# EAGLE design MKL05Z_1.1 (EAGLE 7.4.0)
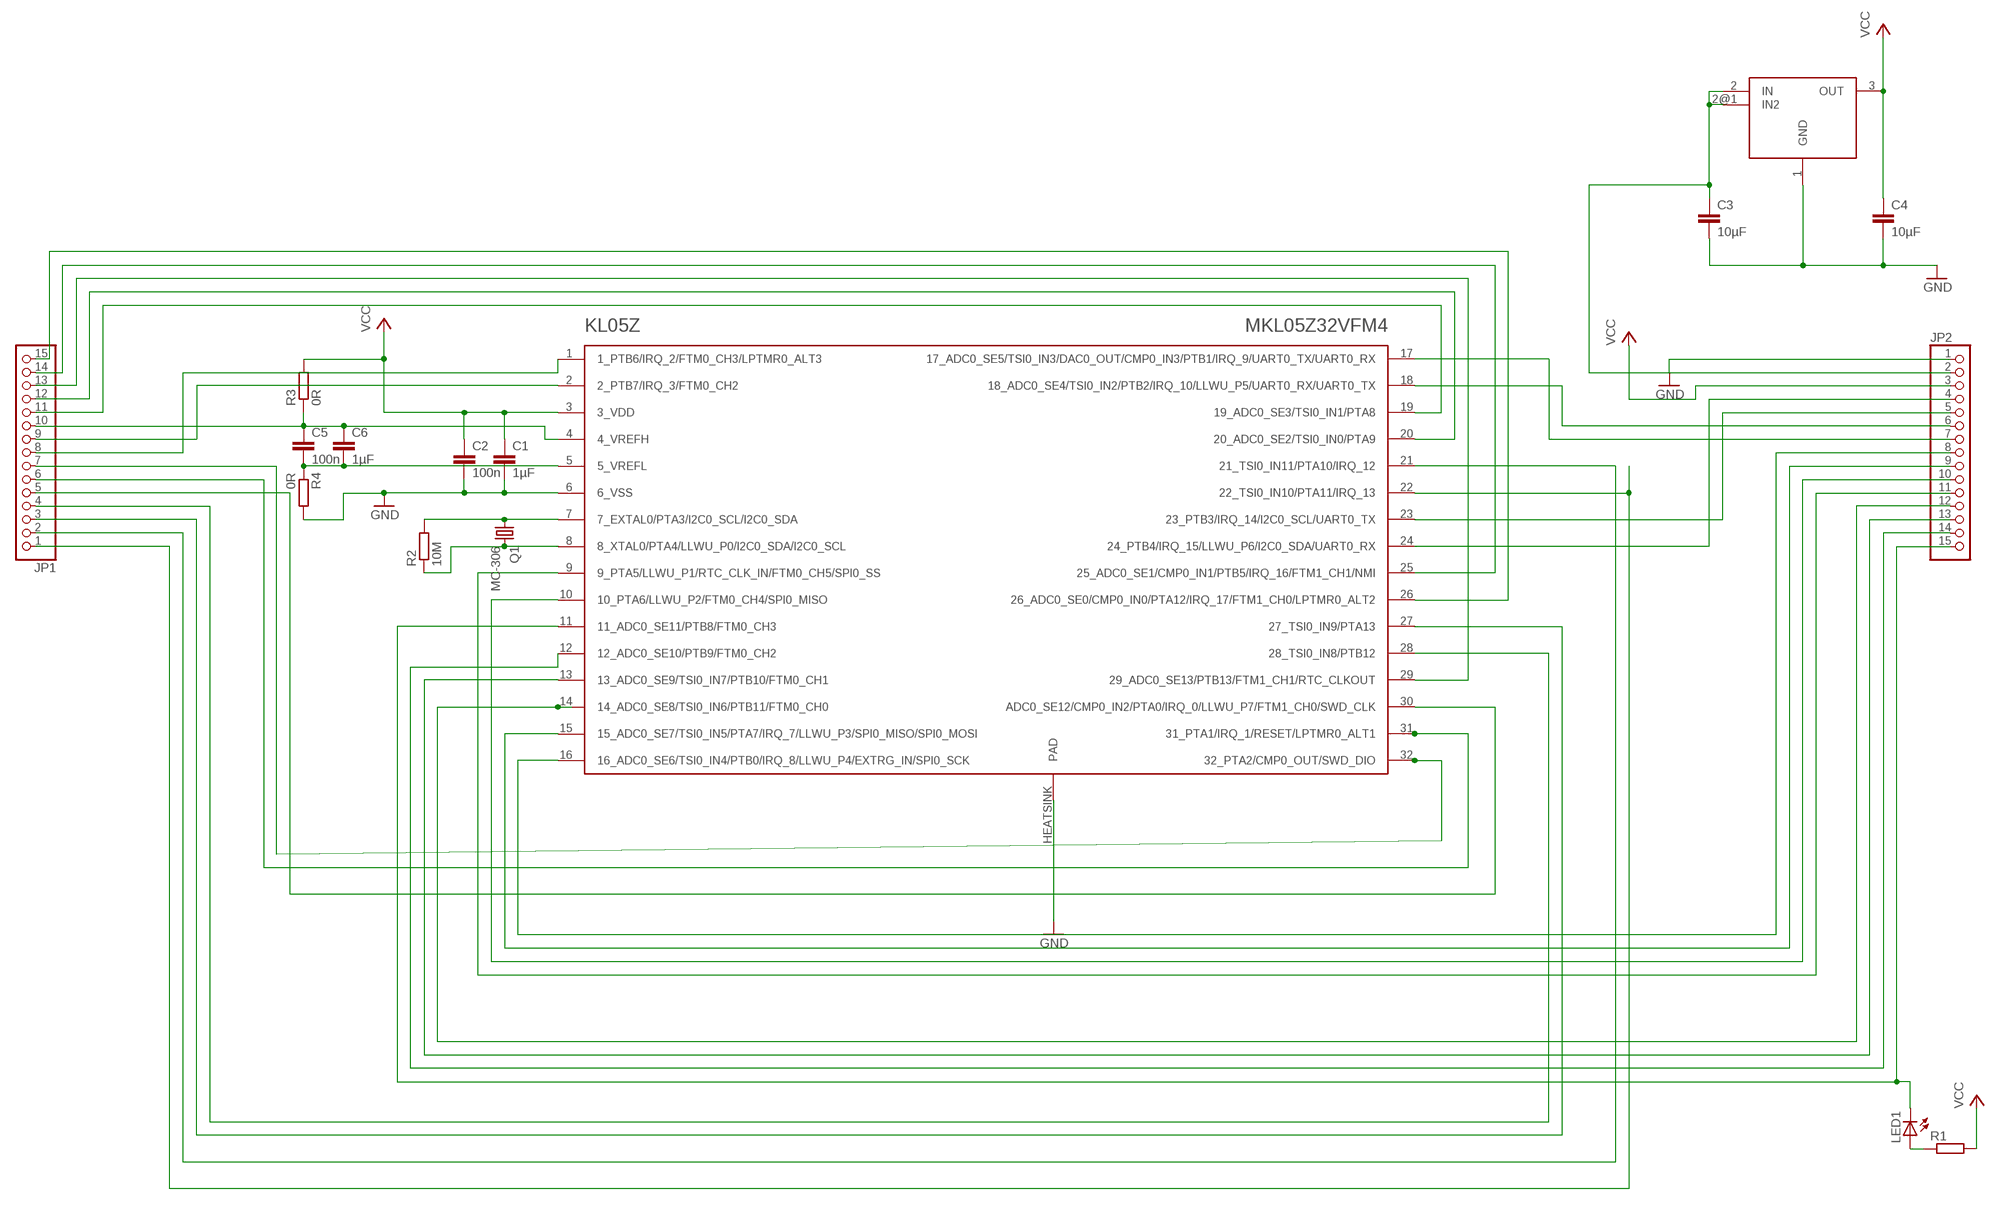
[diagram p0: schematic, sheet 1]

## Parts
C1  1µF  C-EUC0603  [C0603]
C2  100n  C-EUC0603  [C0603]
C3  10µF  C-EUC0805  [C0805]
C4  10µF  C-EUC0805  [C0805]
C5  100n  C-EUC0603  [C0603]
C6  1µF  C-EUC0603  [C0603]
JP1  PINHD-1X15  [1X15]
JP2  PINHD-1X15  [1X15]
KL05Z  MKL05Z32VFM4  MKL15Z128VFM4  [QFN32]
LED1  LEDCHIPLED_0805  [CHIPLED_0805]
Q1  MC-306  [MC-306]
R1  R-EU_R0603  [R0603]
R2  10M  R-EU_R0603  [R0603]
R3  0R  R-EU_R0402  [R0402]
R4  0R  R-EU_R0402  [R0402]
U$1  HT7333  [SOT89]

## Nets
GND: C1.2 C2.2 C3.2 C4.2 JP2.1 KL05Z.6(6_VSS) KL05Z.HEATSINK(PAD) R4.2 U$1.1(GND)
N$1: JP1.6 KL05Z.31(31_PTA1/IRQ_1/RESET/LPTMR0_ALT1)
N$2: JP1.4 KL05Z.28(28_TSI0_IN8/PTB12)
N$3: JP1.5 KL05Z.30(ADC0_SE12/CMP0_IN2/PTA0/IRQ_0/LLWU_P7/FTM1_CH0/SWD_CLK)
N$4: KL05Z.7(7_EXTAL0/PTA3/I2C0_SCL/I2C0_SDA) Q1.1 R2.2
N$5: C5.2 C6.2 KL05Z.5(5_VREFL) R4.1
N$6: C3.1 JP2.2 U$1.2(IN) U$1.2@1(IN2)
N$7: JP2.6 KL05Z.18(18_ADC0_SE4/TSI0_IN2/PTB2/IRQ_10/LLWU_P5/UART0_RX/UART0_TX)
N$8: JP2.7 KL05Z.17(17_ADC0_SE5/TSI0_IN3/DAC0_OUT/CMP0_IN3/PTB1/IRQ_9/UART0_TX/UART0_RX)
N$9: JP2.4 KL05Z.24(24_PTB4/IRQ_15/LLWU_P6/I2C0_SDA/UART0_RX)
N$10: JP2.5 KL05Z.23(23_PTB3/IRQ_14/I2C0_SCL/UART0_TX)
N$11: KL05Z.8(8_XTAL0/PTA4/LLWU_P0/I2C0_SDA/I2C0_SCL) Q1.4 R2.1
N$14: JP2.11 KL05Z.9(9_PTA5/LLWU_P1/RTC_CLK_IN/FTM0_CH5/SPI0_SS)
N$15: JP2.10 KL05Z.10(10_PTA6/LLWU_P2/FTM0_CH4/SPI0_MISO)
N$16: JP2.9 KL05Z.15(15_ADC0_SE7/TSI0_IN5/PTA7/IRQ_7/LLWU_P3/SPI0_MISO/SPI0_MOSI)
N$17: JP2.8 KL05Z.16(16_ADC0_SE6/TSI0_IN4/PTB0/IRQ_8/LLWU_P4/EXTRG_IN/SPI0_SCK)
N$18: JP1.7 KL05Z.32(32_PTA2/CMP0_OUT/SWD_DIO)
N$19: JP1.3 KL05Z.27(27_TSI0_IN9/PTA13)
N$20: JP1.2 KL05Z.21(21_TSI0_IN11/PTA10/IRQ_12)
N$21: JP1.1 KL05Z.22(22_TSI0_IN10/PTA11/IRQ_13)
N$22: C5.1 C6.1 JP1.10 KL05Z.4(4_VREFH) R3.1
N$23: JP1.11 KL05Z.19(19_ADC0_SE3/TSI0_IN1/PTA8)
N$24: JP1.12 KL05Z.20(20_ADC0_SE2/TSI0_IN0/PTA9)
N$25: JP1.13 KL05Z.29(29_ADC0_SE13/PTB13/FTM1_CH1/RTC_CLKOUT)
N$26: JP1.15 KL05Z.26(26_ADC0_SE0/CMP0_IN0/PTA12/IRQ_17/FTM1_CH0/LPTMR0_ALT2)
N$27: JP1.14 KL05Z.25(25_ADC0_SE1/CMP0_IN1/PTB5/IRQ_16/FTM1_CH1/NMI)
N$28: LED1.A R1.1
N$29: JP1.9 KL05Z.2(2_PTB7/IRQ_3/FTM0_CH2)
N$30: JP2.12 KL05Z.14(14_ADC0_SE8/TSI0_IN6/PTB11/FTM0_CH0)
N$31: JP1.8 KL05Z.1(1_PTB6/IRQ_2/FTM0_CH3/LPTMR0_ALT3)
N$32: JP2.13 KL05Z.13(13_ADC0_SE9/TSI0_IN7/PTB10/FTM0_CH1)
N$33: JP2.14 KL05Z.12(12_ADC0_SE10/PTB9/FTM0_CH2)
N$34: JP2.15 KL05Z.11(11_ADC0_SE11/PTB8/FTM0_CH3) LED1.C
VCC: C1.1 C2.1 C4.1 JP2.3 KL05Z.3(3_VDD) R1.2 R3.2 U$1.3(OUT)

## Library data of the parts
C1-C6 = rcl:C-EU: CAPACITOR, European symbol
JP1 JP2 = pinhead:PINHD-1X15: PIN HEADER
KL05Z = kl05z32vfm4:MKL15Z128VFM4
LED1 = led:LED: LED OSRAM: - CHIPLED LG R971, LG N971, LY N971, LG Q971, LY Q971, LO R971, LY R971 LH N974, LH R974 LS Q976, LO Q976, LY Q976 LO Q996 - Hyper CHIPLED LW Q18S LB Q993, LB Q99A, LB R99A - SideLED LS A670, LO A670, LY A670, LG A670, LP A670 LB A673, LV A673, LT A673, LW A673 LH A674 LY A675 LS A676, LA A676, LO A676, LY A676, LW A676 LS A679, LY A679, LG A679 - Hyper Micro SIDELED® LS Y876, LA Y876, LO Y876, LY Y876 LT Y87S - SmartLED LW L88C, LW L88S LB L89C, LB L89S, LG L890 LS L89K, LO L89K, LY L89K LS L896, LA L896, LO L896, LY L896 - TOPLED LS T670, LO T670, LY T670, LG T670, LP T670 LSG T670, LSP T670, LSY T670, LOP T670, LYG T670 LG T671, LOG T671, LSG T671 LB T673, LV T673, LT T673, LW T673 LH T674 LS T676, LA T676, LO T676, LY T676, LB T676, LH T676, LSB T676, LW T676 LB T67C, LV T67C, LT T67C, LS T67K, LO T67K, LY T67K, LW E67C LS E67B, LA E67B, LO E67B, LY E67B, LB E67C, LV E67C, LT E67C LW T67C LS T679, LY T679, LG T679 LS T770, LO T770, LY T770, LG T770, LP T770 LB T773, LV T773, LT T773, LW T773 LH T774 LS E675, LA E675, LY E675, LS T675 LS T776, LA T776, LO T776, LY T776, LB T776 LHGB T686 LT T68C, LB T68C - Hyper Mini TOPLED® LB M676 - Mini TOPLED Santana® LG M470 LS M47K, LO M47K, LY M47K Source: http://www.osram.convergy.de LUXEON: - LUMILED® LXK2-PW12-R00, LXK2-PW12-S00, LXK2-PW14-U00, LXK2-PW14-V00 LXK2-PM12-R00, LXK2-PM12-S00, LXK2-PM14-U00 LXK2-PE12-Q00, LXK2-PE12-R00, LXK2-PE12-S00, LXK2-PE14-T00, LXK2-PE14-U00 LXK2-PB12-K00, LXK2-PB12-L00, LXK2-PB12-M00, LXK2-PB14-N00, LXK2-PB14-P00, LXK2-PB14-Q00 LXK2-PR12-L00, LXK2-PR12-M00, LXK2-PR14-Q00, LXK2-PR14-R00 LXK2-PD12-Q00, LXK2-PD12-R00, LXK2-PD12-S00 LXK2-PH12-R00, LXK2-PH12-S00 LXK2-PL12-P00, LXK2-PL12-Q00, LXK2-PL12-R00 Source: www.luxeon.com KINGBRIGHT: KA-3528ASYC Source: www.kingbright.com
Q1 = crystal:MC-306: kHz RANGE CRYSTAL UNIT SMD Source: MC-306_405_406_E07X.PDF Homepage <http://www.epsontoyocom.co.jp>; MPN: MC-306 60.0KHZ 100PPM ,12.5PF; OC_FARNELL: 1278040; OC_NEWARK: 31M5576
R1-R4 = rcl:R-EU_: RESISTOR, European symbol
U$1 = HT7333:HT7333

## Board
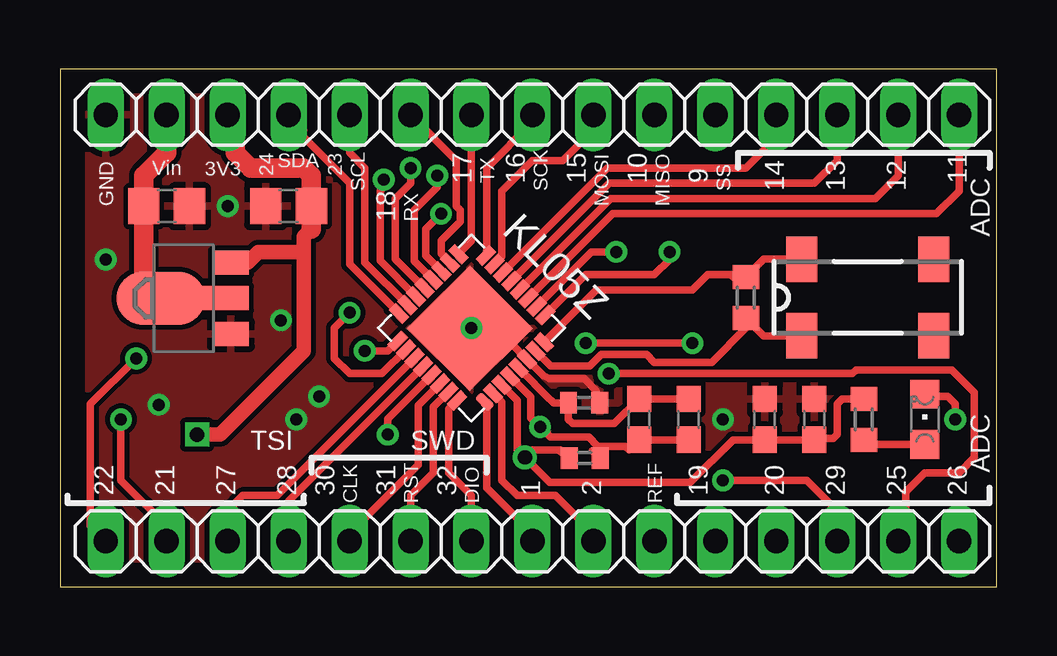
[diagram p1: board, top side]
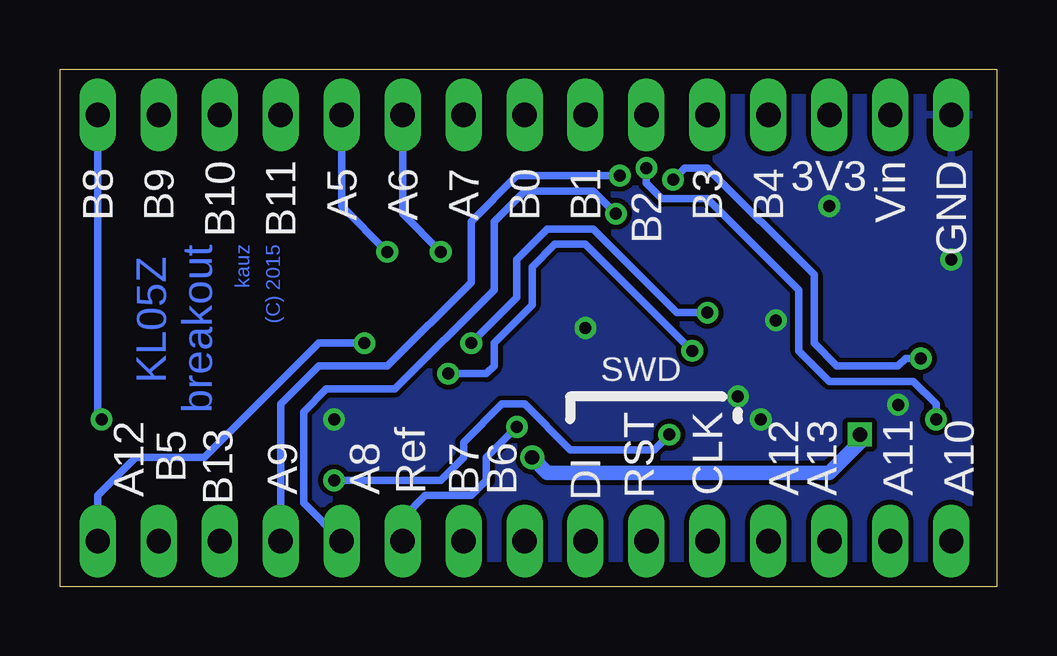
[diagram p2: board, bottom side, seen from below]

Size 39.04 x 21.58 mm. Coordinates in mm from the lower left corner, seen from the top.
Outline: 0,0 39.04,0 39.04,21.58 0,21.58 0,0
Copper layers (1*16): Top 0.035mm / dielectric 1.5mm / Bottom 0.035mm
Design rules "default *": minimum track width 10mil, minimum drill 24mil, track to track 8mil, track to pad 8mil, pad to pad 8mil, via to via 8mil, smd to smd 8mil, copper to edge 40mil, drill to drill 8mil, minimum pad ring 10mil, minimum via ring 8mil, stop-mask expansion 4mil, vias tented up to drill 0.50038125mm, thermal gap 10mil

### Footprints (pad centres in the part's own frame; a part is rotated, then mirrored left to right if it is on the bottom)
C0603 = smd 1.1 x 1: 1 -0.85,0; 2 0.85,0
C0805 = smd 1.3 x 1.5: 1 -0.95,0; 2 0.95,0
1X15 = drill 1.016 long: 1 -17.78,0; 2 -15.24,0; 3 -12.7,0; 4 -10.16,0; 5 -7.62,0; 6 -5.08,0; 7 -2.54,0; 8 0,0; 9 2.54,0; 10 5.08,0; 11 7.62,0; 12 10.16,0; 13 12.7,0; 14 15.24,0; 15 17.78,0
QFN32 = smd 0.813 x 0.406: 1 -2.56,1.79; 2 -2.56,1.29; 3 -2.56,0.79; 4 -2.56,0.29; 5 -2.56,-0.21; 6 -2.56,-0.71; 7 -2.56,-1.21; 8 -2.56,-1.71; 17 2.56,-1.79; 18 2.56,-1.29; 19 2.56,-0.79; 20 2.56,-0.29; 21 2.56,0.21; 22 2.56,0.71; 23 2.56,1.21; 24 2.56,1.71 | smd 0.406 x 0.813: 9 -1.79,-2.56; 10 -1.29,-2.56; 11 -0.79,-2.56; 12 -0.29,-2.56; 13 0.21,-2.56; 14 0.71,-2.56; 15 1.21,-2.56; 16 1.71,-2.56; 25 1.79,2.56; 26 1.29,2.56; 27 0.79,2.56; 28 0.29,2.56; 29 -0.21,2.56; 30 -0.71,2.56; 31 -1.21,2.56; 32 -1.71,2.56 | smd 3.7 x 3.7: HEATSINK 0.04,0.06
CHIPLED_0805 = smd 1.2 x 1.2: A 0,-1.05; C 0,1.05
MC-306 = smd 1.3 x 1.9: 1 -2.75,-1.6; 2 2.75,-1.6; 3 2.75,1.6; 4 -2.75,1.6
R0603 = smd 1 x 1.1: 1 -0.85,0; 2 0.85,0
R0402 = smd 0.7 x 0.9: 1 -0.65,0; 2 0.65,0
SOT89 = smd 1 x 1.5: 1 -1.499,-1.981; 3 1.499,-1.981 | smd 1 x 2: 2 0,-1.727 | smd 2.2 x 3.7: 2@1 0,0.94

### Placement (x,y rotation side)
C1  29.37,6.99 90 top
C2  31.43,6.99 90 top
C3  4.45,15.88 0 top
C4  9.53,15.88 180 top
C5  26.19,6.99 90 top
C6  24.13,6.99 90 top
JP1  19.68,1.91 0 top
JP2  19.68,19.68 0 top
KL05Z  17.14,10.79 135 top
LED1  36.04,6.99 0 top
Q1  33.66,12.06 0 top
R1  33.5,6.99 90 top
R2  28.57,12.06 270 top
R3  21.86,5.37 180 top
R4  21.84,7.68 0 top
U$1  5.14,12.03 90 top

### Tracks (layer width: path | path; a pad name or v marks a point on that pad's centre or on a via)
GND  (via drill 0.5)
  Top 0.305: 18.41,10.79 18.41,10.16 18.78,10.16 KL05Z.6 20.13,8.81 | v17.14,10.79 17.13,10.78 KL05Z.HEATSINK | 20.13,8.81 | 20.13,8.81 20.38,8.69 21.84,8.69 22.35,8.18 22.35,7.55 R4.2
  Top 0.61: v17.14,10.79 18.41,10.79
  other vias: 9.84,6.99 10.79,7.94 6.99,15.88 27.62,6.99 1.91,13.65 9.21,11.11 4.12,7.59
  pour Top: -1.27,-0.64 -1.27,22.86 40.64,22.86 40.64,-1.27 -1.27,-1.27
  pour Bottom: -0.64,-0.64 -0.64,22.22 40.01,22.22 40.01,0 40.01,-0.64
N$1
  Top 0.305: KL05Z.31 15.56,7.5 15.56,4.76 14.61,3.81 JP1.6
N$2
  Top 0.305: KL05Z.28 9.53,3.58 JP1.4
N$3
  Top 0.305: KL05Z.30 14.92,7.57 14.92,5.08 12.06,2.22 JP1.5
N$4
  Top 0.305: KL05Z.7 20.44,9.21 22.07,9.21 22.54,9.68 24.45,9.68 24.76,9.37 27.15,9.37 28.57,10.79 R2.2 29.32,10.46 Q1.1
N$5
  Top 0.305: KL05Z.5 19.77,8.46 19.77,8.45 20.26,7.96 20.56,7.66 21.17,7.66 R4.1 | C5.2 C6.2 23.1,6.81 21.37,6.81 21.19,6.99 R4.1 | 20.94,7.66 R4.1
N$6
  Top 0.813: JP2.2 4.45,18.1 3.49,17.14 C3.1 3.5,12.06 3.81,11.75 3.92,11.75 | 3.92,11.75 5.4,11.75 5.71,12.06 6.84,12.06 U$1.2 | 3.92,11.75 U$1.2@1
N$7
  Top 0.305: KL05Z.18 15.88,13.89 15.88,14.45 16.67,15.24 16.67,15.72 16.51,15.88 16.51,17.78 JP2.6
N$8
  Top 0.305: KL05Z.17 17.14,14.42 JP2.7
N$9
  Top 0.305: 10.16,19.05 JP2.4 9.53,19.37 12.06,16.83 12.06,13.46 KL05Z.24
N$10
  Top 0.305: KL05Z.23 12.7,13.53 12.7,17.46 12.06,18.1 JP2.5
N$11
  Top 0.305: KL05Z.8 22.35,12.38 26.35,12.38 26.99,13.02 27.94,13.02 28.04,12.92 R2.1 29.32,13.67 Q1.4
N$14  (via drill 0.5)
  Top 0.305: KL05Z.9 21.9,13.02 24.76,13.02 25.4,13.65 v25.4,13.97
  Bottom 0.305: v25.4,13.97 27.3,15.88 JP2.11
N$15  (via drill 0.5)
  Top 0.305: KL05Z.10 22.14,13.97 v23.18,13.97
  Bottom 0.305: v23.18,13.97 24.76,15.56 JP2.10
N$16
  Top 0.305: KL05Z.15 18.41,13.78 18.41,16.51 19.68,17.78 20.95,17.78 22.22,19.05 JP2.9
N$17
  Top 0.305: KL05Z.16 17.78,13.85 17.78,17.46 19.68,19.37 JP2.8
N$18
  Top 0.305: KL05Z.32 16.19,7.42 16.19,4.76 17.14,3.81 JP1.7
N$19
  Top 0.305: KL05Z.27 9.04,3.81 7.62,3.81 6.99,3.17 JP1.3 6.99,1.27
N$20  (via drill 0.5)
  Top 0.305: KL05Z.21 13.97,13.67 13.97,16.19 14.61,16.83 v14.61,17.46 | v2.54,6.99 2.54,4.45 4.45,2.54 JP1.2
  Bottom 0.305: v14.61,17.46 14.61,16.83 13.97,16.19 12.06,16.19 8.26,12.38 8.26,9.84 6.99,8.57 3.49,8.57 2.54,7.62 v2.54,6.99
N$21  (via drill 0.5)
  Top 0.305: KL05Z.22 13.34,13.6 13.34,16.51 13.49,16.67 v13.49,16.99 | JP1.1 1.27,2.54 1.27,7.62 v3.17,9.53
  Bottom 0.305: v13.49,16.99 13.02,17.46 12.06,17.46 7.62,13.02 7.62,10.16 6.67,9.21 4.13,9.21 3.81,9.53 v3.17,9.53
N$22  (via drill 0.5)
  Top 0.305: 20,6.65 v20,6.67 | KL05Z.4 19.62,7.91 19.62,7.05 v20,6.67 | C5.1 C6.1 23.71,5.71 23.56,5.87 22.41,5.87 | v20,6.67 20.02,6.68 20.09,6.68 20.29,6.48 | 22.17,5.67 R3.1 22.41,5.87 | 22.41,5.87 22.04,6.25 20.42,6.25 v20,6.67
  Bottom 0.305: v20,6.67 21.27,5.4 21.27,4.45 21.91,3.81 23.81,3.81 24.76,2.86 JP1.10
N$23  (via drill 0.5)
  Top 0.305: KL05Z.19 15.24,13.82 15.24,14.92 v15.88,15.56
  Bottom 0.305: v15.88,15.56 16.83,16.51 19.68,16.51 20.95,15.24 20.95,12.38 25.08,8.26 27.94,8.26 28.89,7.3 28.89,3.49 JP1.11
N$24  (via drill 0.5)
  Top 0.305: KL05Z.20 14.76,13.59 14.76,15.72 15.72,16.67 v15.72,17.14
  Bottom 0.305: v15.72,17.14 20,17.14 21.91,15.24 21.91,12.7 25.4,9.21 28.26,9.21 29.84,7.62 JP1.12
N$25  (via drill 0.5)
  Top 0.305: KL05Z.29 13.65,7.01 v13.65,6.35 | v27.62,4.45 31.11,4.45 32.39,3.17 JP1.13
  Bottom 0.305: v13.65,6.35 14.29,5.71 17.78,5.71 19.68,7.62 20.64,7.62 22.22,6.03 22.22,5.4 23.18,4.45 v27.62,4.45
N$26  (via drill 0.5)
  Top 0.305: v26.35,10.16 v21.91,10.16 | v12.06,11.43 11.43,10.79 11.43,9.53 12.06,8.89 13.42,8.89 KL05Z.26
  Bottom 0.305: JP1.15 37.47,3.81 35.88,5.4 33.02,5.4 28.26,10.16 v26.35,10.16 | v21.91,10.16 20,12.06 20,13.65 18.73,14.92 16.83,14.92 13.34,11.43 v12.06,11.43
N$27  (via drill 0.5)
  Top 0.305: KL05Z.25 13.66,9.84 v12.7,9.84 | v22.86,8.89 33.02,8.89 33.18,9.05 37.15,9.05 38.1,8.1 38.1,5.4 37.47,4.76 36.04,4.76 35.24,3.97 35.24,2.54 34.93,2.22 JP1.14
  Bottom 0.305: v12.7,9.84 17.14,14.29 18.41,14.29 19.37,13.34 19.37,11.75 20.95,10.16 20.95,9.21 21.27,8.89 v22.86,8.89
N$28
  Top 0.305: R1.1 33.7,5.94 LED1.A
N$29
  Top 0.305: KL05Z.2 18.41,7.7 18.41,4.45 19.05,3.81 20.64,3.81 22.22,2.22 JP1.9
N$30
  Top 0.305: KL05Z.14 22.81,17.46 28.57,17.46 29.84,18.73 JP2.12
N$31
  Top 0.305: KL05Z.1 17.78,7.63 17.78,4.13 19.68,2.22 JP1.8
N$32
  Top 0.305: KL05Z.13 22.88,16.83 31.43,16.83 32.39,17.78 JP2.13
N$33
  Top 0.305: KL05Z.12 22.95,16.19 33.97,16.19 34.93,17.14 JP2.14
N$34  (via drill 0.5)
  Top 0.305: KL05Z.11 23.02,15.56 36.51,15.56 37.47,16.51 JP2.15 | LED1.C 36.13,7.94 36.99,7.94 37.31,7.62 v37.31,6.99
  Bottom 0.305: v37.31,6.99 37.47,7.14 JP2.15
VCC  (via drill 0.6)
  Top 0.305: KL05Z.3 19.05,7.77 19.05,5.71 v19.37,5.4 | v19.37,5.4 20,4.76 20.41,4.35 26.26,4.35 28.04,6.13 C1.1 C2.1 31.49,6.19 32.23,6.19 32.39,6.35 32.39,7.62 32.6,7.84 R1.2 | v19.37,5.4 19.68,5.71 20.75,5.71 R3.2 20.83,5.71
  Top 0.61: v5.71,6.35 6.67,6.35 10.16,9.84 10.16,13.97 | 10.16,13.97 10.16,14.61 10.47,14.92 | U$1.3 7.82,13.53 8.26,13.97 10.16,13.97
  Top 0.813: JP2.3 7.3,19.37 7.3,18.1 7.94,17.46 10.16,17.46 10.47,17.15 C4.1 10.47,14.92
  Bottom 0.61: v19.37,5.4 18.73,4.76 6.99,4.76 5.71,6.03 v5.71,6.35

### Text on the board
Bottom: (C) 2015 | kauz | KL05Z / breakout
tPlace: SDA | Vin | 3V3 | 24 | 23 | GND | SCL | 17 | TX | 16 | SCK | 15 | MOSI | 10 | MISO | 9 | SS | 14 | 13 | 12 | 11 | 18 | RX | ADC | TSI | SWD | ADC | 22 | 21 | 27 | 28 | 30 | CLK | 31 | RST | 32 | DIO | 1 | 2 | REF | 19 | 20 | 29 | 25 | 26
bPlace: GND | Vin | 3V3 | B4 | B3 | B1 | B0 | A7 | A6 | A5 | B11 | B10 | B9 | B8 | B8 | B2 | SWD | A10 | A11 | A13 | A12 | CLK | RST | A12 | B6 | B7 | Ref | A8 | A9 | B13 | B5 | DI